# Altium schematic sheet EEPROM.SchDoc
size A4; SheetNumber: 14; SheetTotal: 22
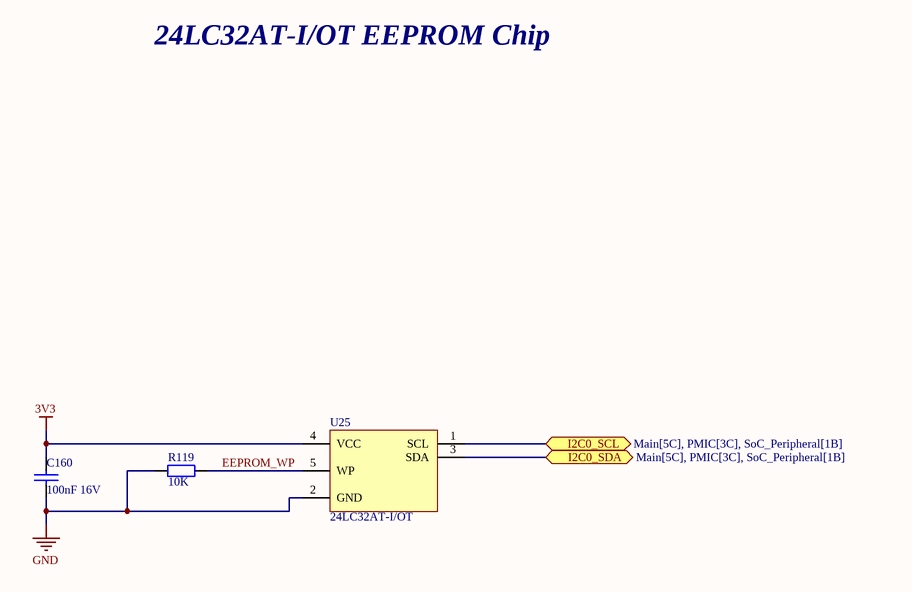
[diagram p0: EEPROM.SchDoc]

## Parts
C160  100nF 16V  [C_0402]
R119  10K  [R_0402]
U25  24LC32AT-I/OT  [SOT-23-5]

## Ports
I2C0_SCL (bidir, see Main[5C], PMIC[3C], SoC_Peripheral[1B]), I2C0_SDA (bidir, see Main[5C], PMIC[3C], SoC_Peripheral[1B])

## Nets
3V3: C160.1 U25.4(VCC)
GND: C160.2 R119.2 U25.2(GND)
EEPROM_WP: R119.1 U25.5(WP)
I2C0_SCL: U25.1(SCL) ; port I2C0_SCL
I2C0_SDA: U25.3(SDA) ; port I2C0_SDA

## Notes on the sheet
- 24LC32AT-I/OT EEPROM Chip

## Library data of the parts
C160 = C_0402: Capacitor 0402 SMD
R119 = R_0402: Resistor 0402 SMD
U25 = 24LC32AT-I/OT: 32Kbit 400kHz I2C SOT-23-5 EEPROM ROHS; Manufacturer: Microchip Tech; Manufacturer Part Number: 24LC32AT-I/OT; ComponentLink1Description: Datasheet Link; ComponentLink1URL: https://ww1.microchip.com/downloads/aemDocuments/documents/MPD/ProductDocuments/DataSheets/24AA32A-24LC32A-32-Kbit-I2C-Serial-EEPROM-DS20001713.pdf